# EAGLE design M119C (EAGLE 6.6.0)
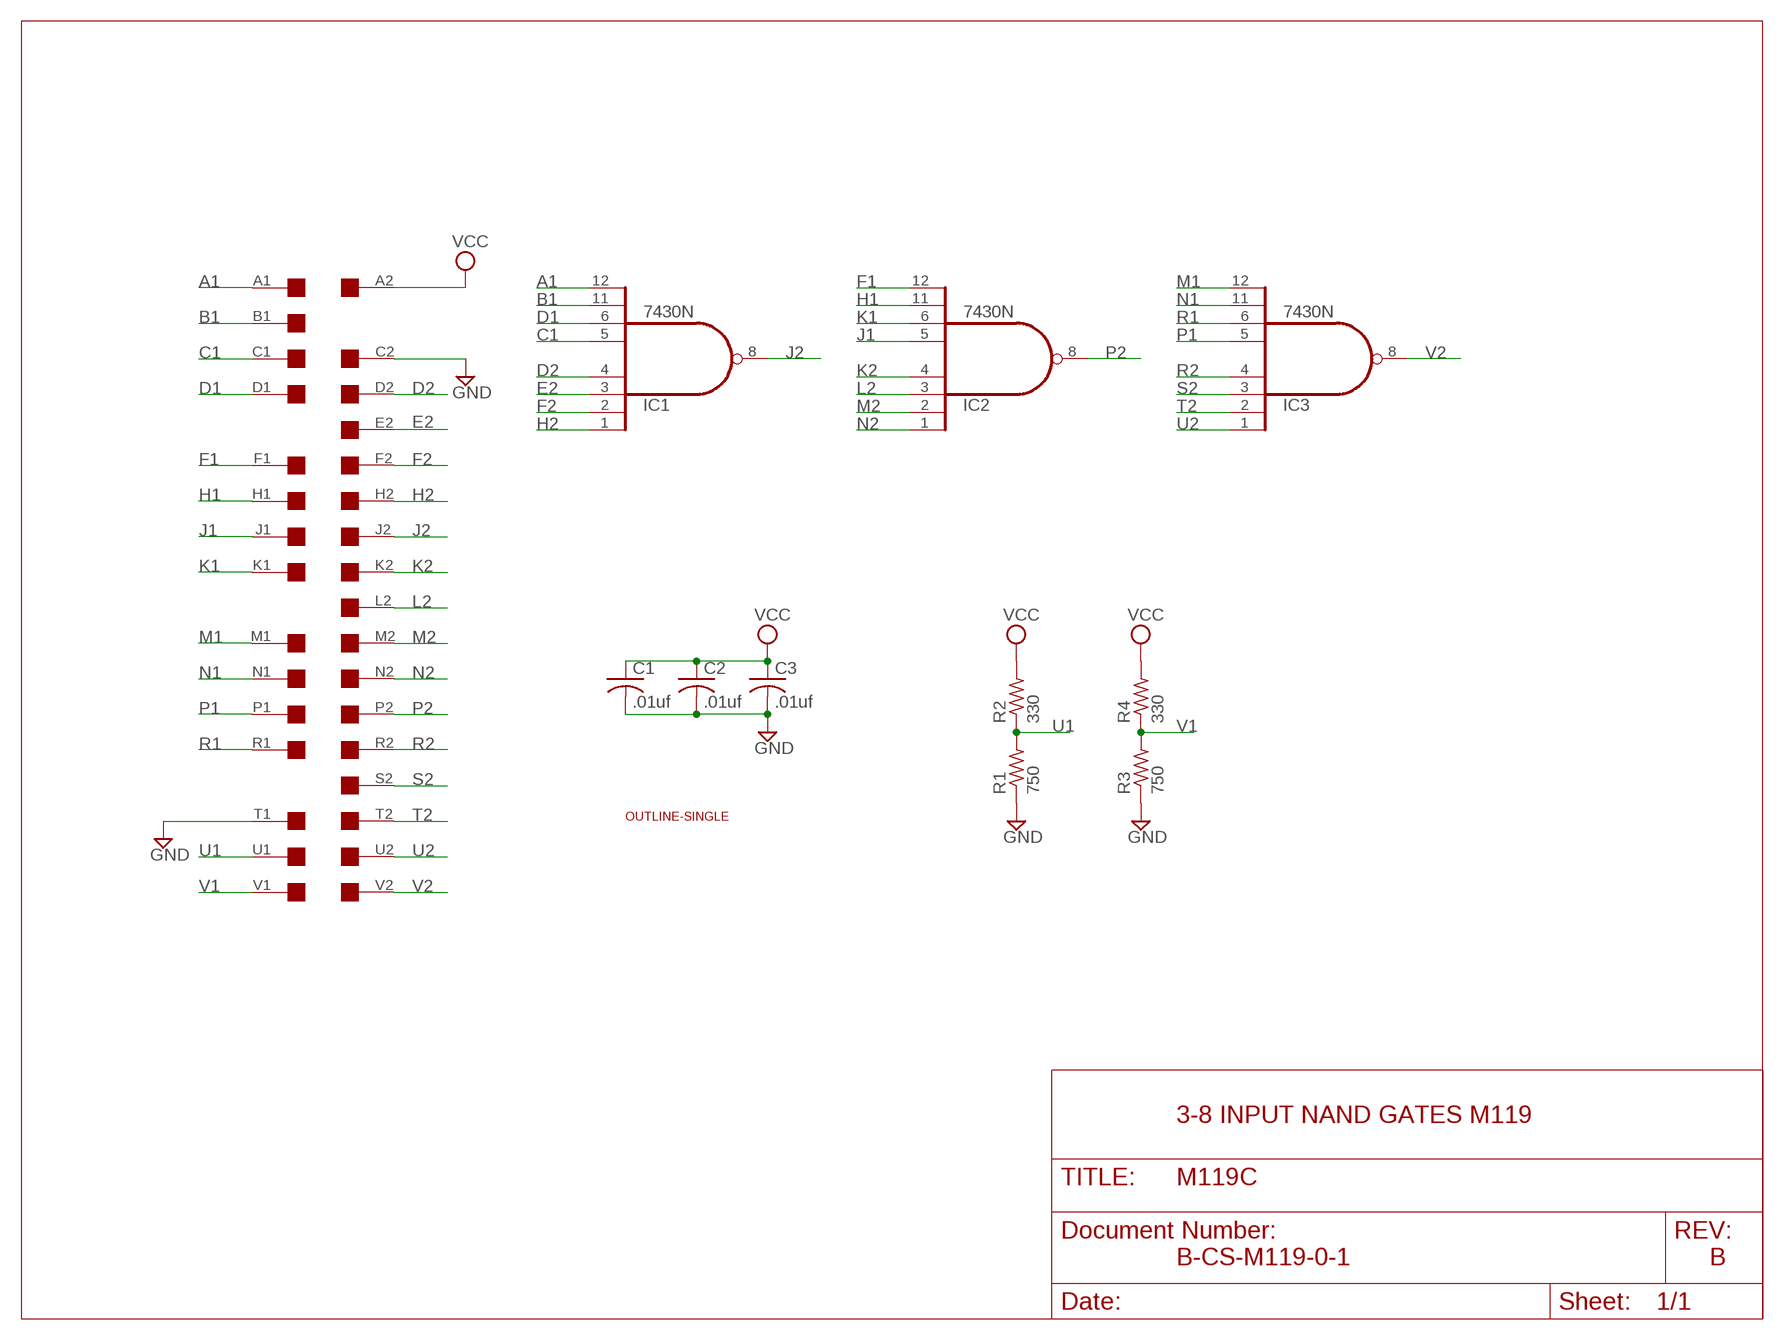
[diagram p0: schematic, sheet 1]

## Parts
C1  .01uf  C-US050-025X075  [C050-025X075]
C2  .01uf  C-US050-025X075  [C050-025X075]
C3  .01uf  C-US050-025X075  [C050-025X075]
IC1  7430N  [DIL14]
IC2  7430N  [DIL14]
IC3  7430N  [DIL14]
R1  750  R-US_0207/10  [0207/10]
R2  330  R-US_0207/10  [0207/10]
R3  750  R-US_0207/10  [0207/10]
R4  330  R-US_0207/10  [0207/10]
U$1  OUTLINE-SINGLE  [SINGLE]
U$4  SINGLE  [EDGE-CON2]

## Nets
A1: IC1.12(I7) U$4.A1
B1: IC1.11(I6) U$4.B1
C1: IC1.5(I4) U$4.C1
D1: IC1.6(I5) U$4.D1
D2: IC1.4(I3) U$4.D2
E2: IC1.3(I2) U$4.E2
F1: IC2.12(I7) U$4.F1
F2: IC1.2(I1) U$4.F2
GND [Supply]: C1.2 C2.2 C3.2 R1.1 R3.1 U$4.C2 U$4.T1
H1: IC2.11(I6) U$4.H1
H2: IC1.1(I0) U$4.H2
J1: IC2.5(I4) U$4.J1
J2: IC1.8(O) U$4.J2
K1: IC2.6(I5) U$4.K1
K2: IC2.4(I3) U$4.K2
L2: IC2.3(I2) U$4.L2
M1: IC3.12(I7) U$4.M1
M2: IC2.2(I1) U$4.M2
N1: IC3.11(I6) U$4.N1
N2: IC2.1(I0) U$4.N2
P1: IC3.5(I4) U$4.P1
P2: IC2.8(O) U$4.P2
R1: IC3.6(I5) U$4.R1
R2: IC3.4(I3) U$4.R2
S2: IC3.3(I2) U$4.S2
T2: IC3.2(I1) U$4.T2
U1: R1.2 R2.1 U$4.U1
U2: IC3.1(I0) U$4.U2
V1: R3.2 R4.1 U$4.V1
V2: IC3.8(O) U$4.V2
VCC [Supply]: C1.1 C2.1 C3.1 R2.2 R4.2 U$4.A2
Unconnected: U$4.B2 U$4.E1 U$4.L1 U$4.S1

## Notes on the sheet
- 3-8 INPUT NAND GATES M119
- B-CS-M119-0-1 | B

## Power pins joined to a net without a drawn wire
GND: IC1.7(GND) IC2.7(GND) IC3.7(GND)
VCC: IC1.14(VCC) IC2.14(VCC) IC3.14(VCC)

## Library data of the parts
C1-C3 = rcl:C-US: CAPACITOR, American symbol
IC1-IC3 = 74xx-us:74*30: 8-input NAND gate
R1-R4 = rcl:R-US_: RESISTOR, American symbol
U$1 = dec-con:OUTLINE-*: Board outlines for DEC boards.
U$4 = dec-con:SINGLE: Single-Height DEC board

## Net classes
1 Supply: width 0.813 mm

## Board
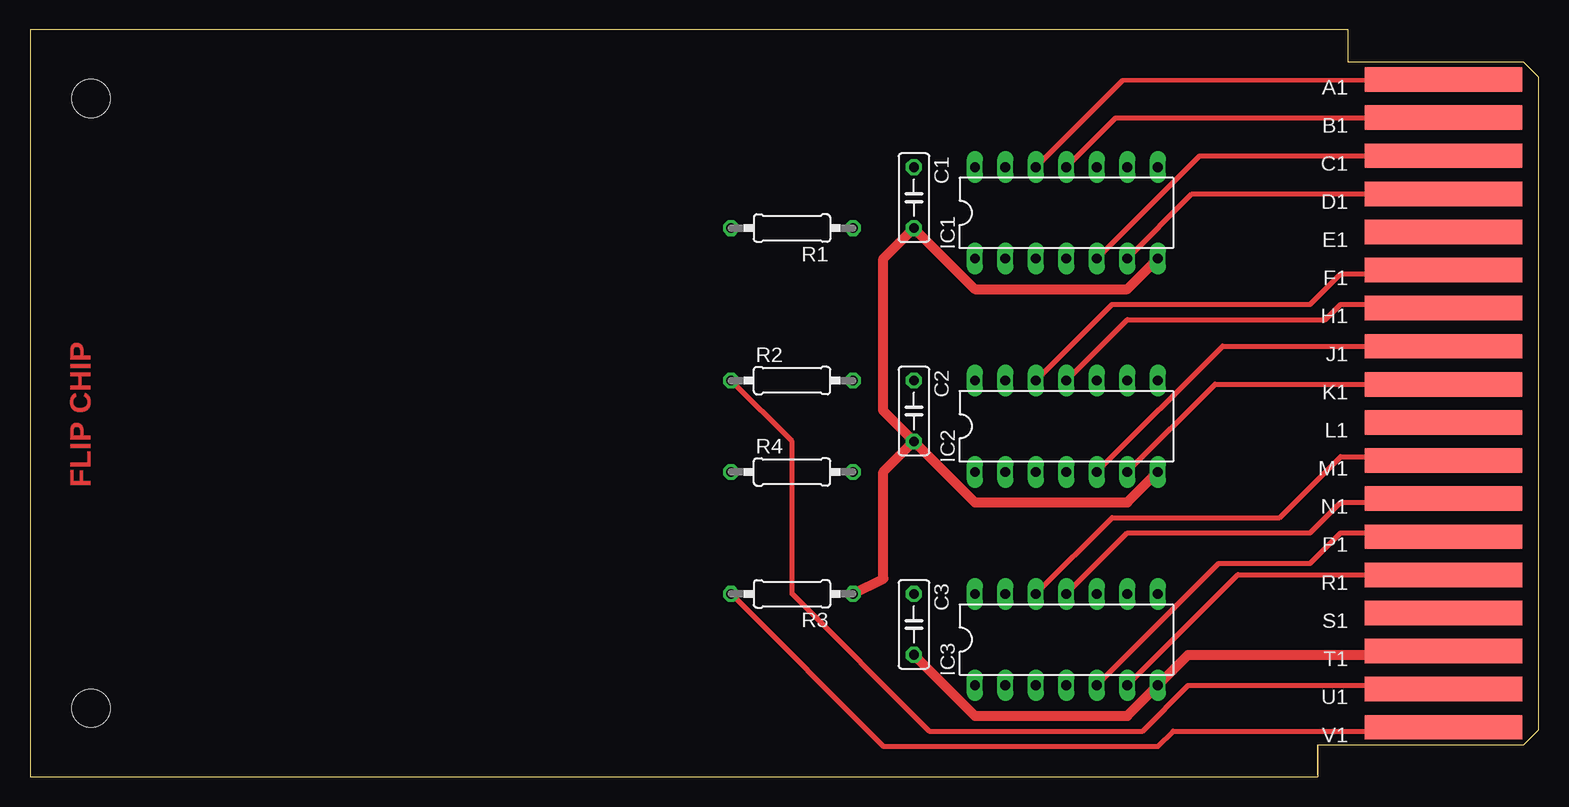
[diagram p1: board, top side]
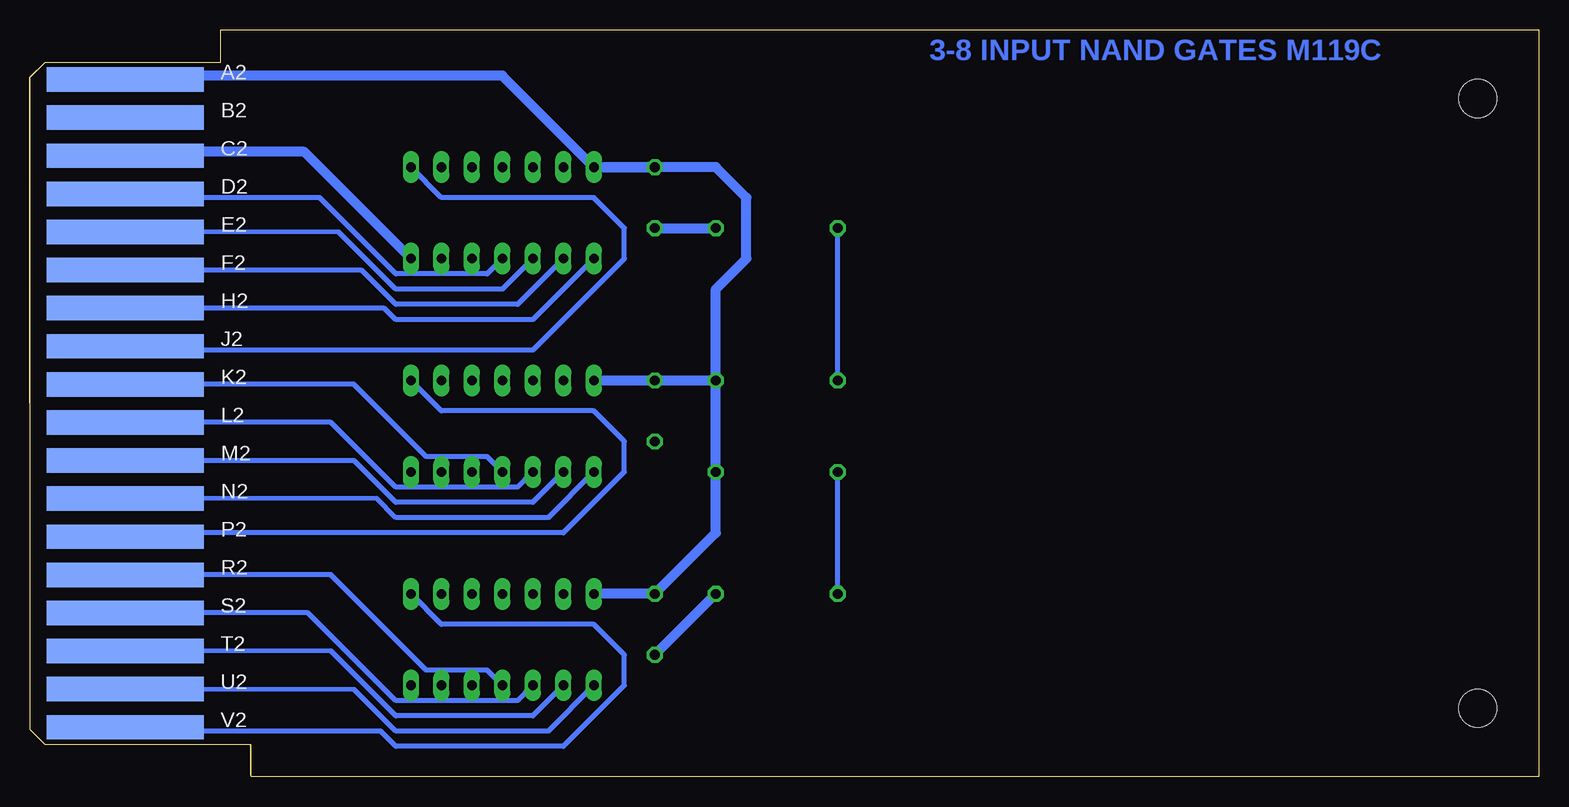
[diagram p2: board, bottom side, seen from below]

Size 125.73 x 62.23 mm. Coordinates in mm from the lower left corner, seen from the top.
Copper layers (1*16): Top 0.035mm / dielectric 1.5mm / Bottom 0.035mm
Design rules "16mils": minimum track width 16mil, minimum drill 24mil, track to track 15mil, track to pad 10mil, pad to pad 10mil, via to via 10mil, smd to smd 10mil, copper to edge 25mil, drill to drill 10mil, minimum pad ring 10mil, minimum via ring 8mil, stop-mask expansion 0mil, vias tented up to drill 0mil, thermal gap 10mil

### Footprints (pad centres in the part's own frame; a part is rotated, then mirrored left to right if it is on the bottom)
C050-025X075 = drill 0.813 octagon: 1 -2.54,0; 2 2.54,0
DIL14 = drill 0.813 long: 1 -7.62,-3.81; 2 -5.08,-3.81; 3 -2.54,-3.81; 4 0,-3.81; 5 2.54,-3.81; 6 5.08,-3.81; 7 7.62,-3.81; 8 7.62,3.81; 9 5.08,3.81; 10 2.54,3.81; 11 0,3.81; 12 -2.54,3.81; 13 -5.08,3.81; 14 -7.62,3.81
0207/10 = drill 0.813 octagon: 1 -5.08,0; 2 5.08,0
SINGLE = hole 3.175: 120.65,56.515; 120.65,5.715
EDGE-CON2 = smd 13.106 x 2.032: A1 7.938,4.128; B1 7.938,7.303; C1 7.938,10.477; D1 7.938,13.652; E1 7.938,16.828; F1 7.938,20.003; H1 7.938,23.177; J1 7.938,26.352; K1 7.938,29.527; L1 7.938,32.703; M1 7.938,35.877; N1 7.938,39.053; P1 7.938,42.227; R1 7.938,45.403; S1 7.938,48.578; T1 7.938,51.752; U1 7.938,54.928; V1 7.938,58.102 | smd 13.106 x 2.032 bottom: A2 7.938,4.128; B2 7.938,7.303; C2 7.938,10.477; D2 7.938,13.652; E2 7.938,16.828; F2 7.938,20.003; H2 7.938,23.177; J2 7.938,26.352; K2 7.938,29.527; L2 7.938,32.703; M2 7.938,35.877; N2 7.938,39.053; P2 7.938,42.227; R2 7.938,45.403; S2 7.938,48.578; T2 7.938,51.752; U2 7.938,54.928; V2 7.938,58.102

### Placement (x,y rotation side)
C1  73.66,48.26 270 top
C2  73.66,30.48 270 top
C3  73.66,12.7 270 top
IC1  86.36,46.99 0 top
IC2  86.36,29.21 0 top
IC3  86.36,11.43 0 top
R1  63.5,45.72 180 top
R2  63.5,33.02 0 top
R3  63.5,15.24 180 top
R4  63.5,25.4 0 top
U$1  125.73,62.23 180 top
U$4  125.73,62.23 180 top

### Tracks (layer width: path | path; a pad name or v marks a point on that pad's centre or on a via)
A1
  Top 0.406: U$4.A1 91.04,58.02 IC1.12
B1
  Top 0.406: U$4.B1 90.46,54.9 IC1.11
C1
  Top 0.406: U$4.C1 97.46,51.74 IC1.5
D1
  Top 0.406: U$4.D1 96.83,48.56 IC1.6
D2
  Bottom 0.406: U$4.D2 112.06,48.56 111.76,48.26 101.6,48.26 95.25,41.91 87.63,41.91 IC1.4
E2
  Bottom 0.406: U$4.E2 100,45.39 95.25,40.64 86.36,40.64 IC1.3
F1
  Top 0.406: U$4.F1 112.04,42.19 111.76,41.91 109.22,41.91 106.68,39.37 90.17,39.37 IC2.12
F2
  Bottom 0.406: U$4.F2 98.07,42.19 95.25,39.37 85.09,39.37 IC1.2
GND
  Top 0.813: IC1.7 91.44,40.64 78.74,40.64 C1.2 71.12,43.18 71.12,30.48 C2.2 | R3.1 71.12,16.51 71.12,25.4 C2.2 | C3.2 78.74,5.08 91.44,5.08 IC3.7 96.52,10.16 111.76,10.16 112.09,10.49 U$4.T1 | IC2.7 91.44,22.86 78.74,22.86 C2.2
  Bottom 0.813: C1.2 R1.1 | R3.1 C3.2 | U$4.C2 112.09,51.74 111.76,52.07 102.87,52.07 IC1.7
H1
  Top 0.406: U$4.H1 112.09,39.04 111.76,39.37 109.22,39.37 107.95,38.1 91.44,38.1 IC2.11
H2
  Bottom 0.406: U$4.H2 96.19,39.04 95.25,38.1 83.82,38.1 IC1.1
J1
  Top 0.406: U$4.J1 99.39,35.89 IC2.5
J2
  Bottom 0.406: U$4.J2 112.09,35.89 111.76,35.56 83.82,35.56 76.2,43.18 76.2,45.72 78.74,48.26 91.44,48.26 IC1.8
K1
  Top 0.406: U$4.K1 98.75,32.72 IC2.6
K2
  Bottom 0.406: U$4.K2 98.75,32.72 92.71,26.67 87.63,26.67 IC2.4
L2
  Bottom 0.406: U$4.L2 100.66,29.54 95.25,24.13 85.09,24.13 IC2.3
M1
  Top 0.406: U$4.M1 111.76,26.67 109.22,26.67 104.14,21.59 90.17,21.59 IC3.12
M2
  Bottom 0.406: U$4.M2 98.73,26.34 95.25,22.86 83.82,22.86 IC2.2
N1
  Top 0.406: U$4.N1 112.09,23.19 111.76,22.86 109.22,22.86 106.68,20.32 91.44,20.32 IC3.11
N2
  Bottom 0.406: U$4.N2 96.85,23.19 95.25,21.59 82.55,21.59 IC2.1
P1
  Top 0.406: U$4.P1 111.76,20.32 109.22,20.32 106.68,17.78 104.14,17.78 99.06,17.78 IC3.5
P2
  Bottom 0.406: U$4.P2 112.09,19.99 111.76,20.32 81.28,20.32 76.2,25.4 76.2,27.94 78.74,30.48 91.44,30.48 IC2.8
R1
  Top 0.406: U$4.R1 100.66,16.84 IC3.6
R2
  Bottom 0.406: U$4.R2 100.66,16.84 92.71,8.89 87.63,8.89 IC3.4
S2
  Bottom 0.406: U$4.S2 102.56,13.66 95.25,6.35 85.09,6.35 IC3.3
T2
  Bottom 0.406: U$4.T2 100.66,10.49 95.25,5.08 83.82,5.08 IC3.2
U1
  Top 0.406: U$4.U1 112.12,7.26 111.76,7.62 96.52,7.62 92.71,3.81 74.93,3.81 63.5,15.24 63.5,27.94 R2.1
  Bottom 0.406: R2.1 R1.2
U2
  Bottom 0.406: U$4.U2 98.7,7.26 95.25,3.81 82.55,3.81 IC3.1
V1
  Top 0.406: U$4.V1 112.15,4.2 111.76,3.81 95.25,3.81 93.98,2.54 71.12,2.54 R3.2
  Bottom 0.406: R3.2 R4.1
V2
  Bottom 0.406: U$4.V2 112.15,4.2 111.76,3.81 96.52,3.81 95.25,2.54 81.28,2.54 76.2,7.62 76.2,10.16 78.74,12.7 91.44,12.7 IC3.8
VCC
  Bottom 0.813: U$4.A2 112.16,58.02 111.76,58.42 86.36,58.42 IC1.14 | IC1.14 C1.1 | R2.2 C2.1 IC2.14 | IC3.14 C3.1 68.58,20.32 R4.2 R2.2 | IC1.14 68.58,50.8 66.04,48.26 66.04,43.18 68.58,40.64 R2.2

### Text on the board
Top: FLIP CHIP
Bottom: 3-8 INPUT NAND GATES M119C